# Altium project Microcontroller Hardware.PrjPcb (part 3 of 3)

## Sheet MCU025B_XDS110_USB_Power.SchDoc
size 431 x 279 mm; PageSetup: Record=PageOptions|CenterHorizontal=True|CenterVertical=True|PrintScale=1.00|XCorrection=1.00|YCorrection=1.00|PrintKind=0|BorderSize=5000000|LeftOffset=0|BottomOffset=0|Orientation=2|PaperLength=1000|PaperWidth=1000|Scale=100|PaperSource=15|PrintQuality=600|MediaType=1|DitherType=10|PaperKind=Letter|PrintScaleMode=1; SPICEModelCacheRPHRLOIN: <root> / <DocumentId>RPHRLOIN</DocumentId> / </root>; Organization: ORGANIZATION; Address1: ADDRESS 1; Address2: ADDRESS 2; Address3: ADDRESS 3; Address4: ADDRESS 4; Revision: -; ENG_APP_DATE: --/--/--; DSN_APP_DATE: --/--/--; CHK_APP_DATE: --/--/--
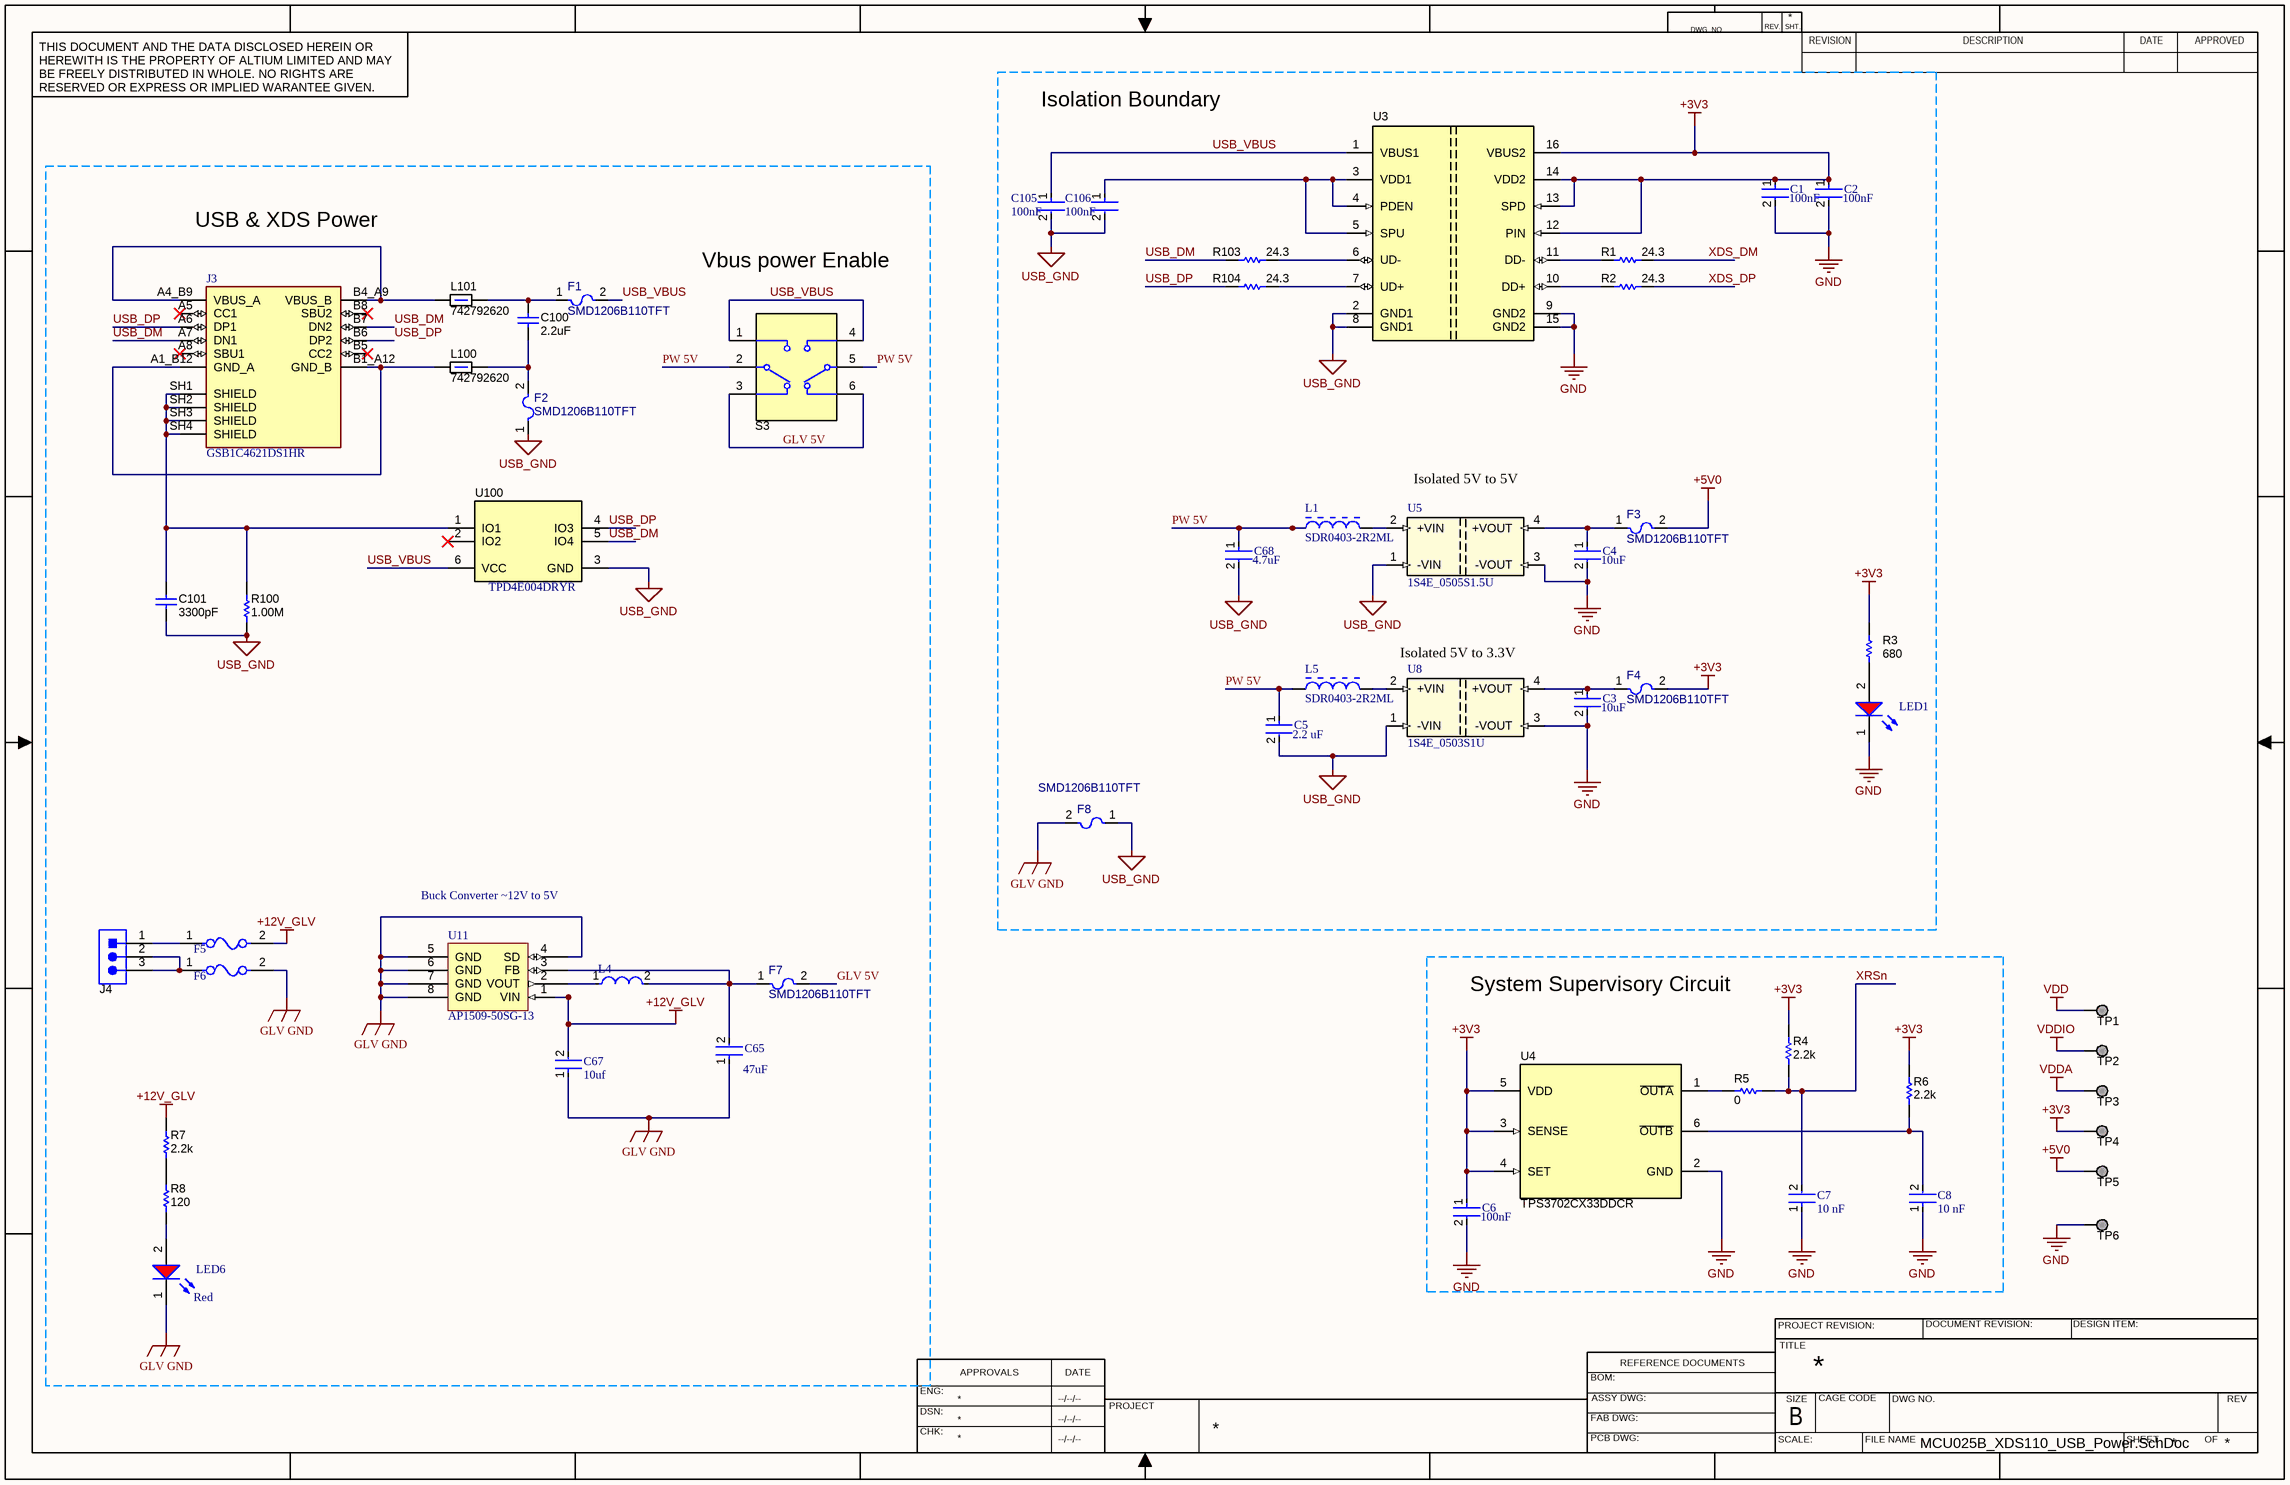
[diagram p7: MCU025B_XDS110_USB_Power.SchDoc]

### Parts
(Parts that share a designator on the sheet are numbered #1, #2 ... from top to bottom, then left to right.)
C1  Capacitance: 100nF  [FP-CL10-IPC_C]  (hidden comment: CL10B104KA8NFNC)
C2  Capacitance: 100nF  [FP-CL10-IPC_C]  (hidden comment: CL10B104KA8NFNC)
C3  Capacitance: 10uF  [FP-GRM188-0_15-MFG]  (hidden comment: GRM188R61A106ME69D)
C4  Capacitance: 10uF  [FP-GRM188-0_15-MFG]  (hidden comment: GRM188R61A106ME69D)
C5  Capacitance: 2.2 uF  [FP-CC0805-0_85-MFG]  (hidden comment: CC0805KKX7R5BB225)
C6  Capacitance: 100nF  [FP-CL10-IPC_C]  (hidden comment: CL10B104KA8NFNC)
C7  Capacitance: 10 nF  [FP-CC0603-DA-MFG]  (hidden comment: CC0603KRX7R6BB103)
C8  Capacitance: 10 nF  [FP-CC0603-DA-MFG]  (hidden comment: CC0603KRX7R6BB103)
C65  47uF  [FP-GRM31C-0_2-e0_3_0_8-IPC_C]
C67  10uf  [FP-GRM21B-0_1-IPC_C]
C68  Capacitance: 4.7uF  [FP-CL10-IPC_A]  (hidden comment: CL10X475KQ8NNNC)
C100  ValueDisplayed: 2.2uF  [0402]  (hidden comment: GRM155R60J225KE95D)
C101  ValueDisplayed: 3300pF  [0402]  (hidden comment: GRM155R71H332KA01D)
C105  Capacitance: 100nF  [FP-CL10-IPC_C]  (hidden comment: CL10B104KA8NFNC)
C106  Capacitance: 100nF  [FP-CL10-IPC_C]  (hidden comment: CL10B104KA8NFNC)
F1  SMD1206B110TFT  [SMD1206B110TFT-Footprint-1]
F2  SMD1206B110TFT  [SMD1206B110TFT-Footprint-1]
F3  SMD1206B110TFT  [SMD1206B110TFT-Footprint-1]
F4  SMD1206B110TFT  [SMD1206B110TFT-Footprint-1]
F5  MF-MSMF110/16-2  [FP-MF-MSMF110-16-MFG]  (value not drawn)
F6  MF-MSMF110/16-2  [FP-MF-MSMF110-16-MFG]  (value not drawn)
F7  SMD1206B110TFT  [SMD1206B110TFT-Footprint-1]
F8  SMD1206B110TFT  [SMD1206B110TFT-Footprint-1]
J3  GSB1C4621DS1HR  [AMPHENOL_GSB1C4621DS1HR]
J4#2  61300211121  [WURTH_61300211121]  (value not drawn)
L1  SDR0403-2R2ML  [BOUR-SDR0403-2_V]
L4  IHLP2525AHER4R7M01  [FP-IHLP-2525AH-FP_2_413x3-MFG]  (value not drawn)
L5  SDR0403-2R2ML  [BOUR-SDR0403-2_V]
L100  742792620  [0603]
L101  742792620  [0603]
LED1  150080SS75000  [WL-SMCW_0805_150080xx75000]  (value not drawn)
LED6  Color: Red  [WL-SMCW_0805_150080xx75000]  (hidden comment: 150080SS75000)
R1  ValueDisplayed: 24.3  [0402]  (hidden comment: CRCW040224R3FKED)
R2  ValueDisplayed: 24.3  [0402]  (hidden comment: CRCW040224R3FKED)
R3  ValueDisplayed: 680  [0402]  (hidden comment: CRCW0402680RJNED)
R4  ValueDisplayed: 2.2k  [0402]  (hidden comment: CRCW04022K20JNED)
R5  ValueDisplayed: 0  [0402]  (hidden comment: CRCW04020000Z0ED)
R6  ValueDisplayed: 2.2k  [0603]  (hidden comment: CRCW06032K20JNEA)
R7  ValueDisplayed: 2.2k  [0603]  (hidden comment: CRCW06032K20JNEA)
R8  ValueDisplayed: 120  [0603]  (hidden comment: RC0603FR-07120RL)
R100  ValueDisplayed: 1.00M  [0402]  (hidden comment: CRCW04021M00FKED)
R103  ValueDisplayed: 24.3  [0402]  (hidden comment: CRCW040224R3FKED)
R104  ValueDisplayed: 24.3  [0402]  (hidden comment: CRCW040224R3FKED)
S3  CAS-220TA  [SW_CAS-220TA]  (value not drawn)
TP1  TESTPOINT  [TESTPOINT]  (value not drawn)  (no BOM)
TP2  TESTPOINT  [TESTPOINT]  (value not drawn)  (no BOM)
TP3  TESTPOINT  [TESTPOINT]  (value not drawn)  (no BOM)
TP4  TESTPOINT  [TESTPOINT]  (value not drawn)  (no BOM)
TP5  TESTPOINT  [TESTPOINT]  (value not drawn)  (no BOM)
TP6  TESTPOINT  [TESTPOINT]  (value not drawn)  (no BOM)
U3  ADuM3160BRWZ  [SOIC-16]  (value not drawn)
U4  TPS3702CX33DDCR  [DDC0006A_N]
U5  1S4E_0505S1.5U  [1S4E_0503S1U-Footprint-1]
U8  1S4E_0503S1U  [1S4E_0503S1U-Footprint-1]
U11  AP1509-50SG-13  [AP1509-50SG-13-Footprint-1]
U100  TPD4E004DRYR  [DRY0006A]

### Nets
+3V3: C1.1 C2.1 C6.1 F4.2 R3.2 R4.2 R6.2 TP4.1 U3.12(PIN) U3.13(SPD) U3.14(VDD2) U3.16(VBUS2) U4.3(SENSE) U4.4(SET) U4.5(VDD)
+5V0: F3.2 TP5.1
+12V_GLV: C67.2 F5.2 R7.2 U11.1(VIN)
GLV GND: C65.1 C67.1 F6.2 F8.2 LED6.1(K) U11.4(SD) U11.5(GND) U11.6(GND) U11.7(GND) U11.8(GND)
GND: C1.2 C2.2 C3.2 C4.2 C6.2 C7.1 C8.1 LED1.1(K) TP6.1 U3.9(GND2) U3.15(GND2) U4.2(GND) U5.3(-VOUT) U8.3(-VOUT)
USB_GND: C5.2 C68.2 C101.2 C105.2 C106.2 F2.1 F8.1 R100.1 U3.2(GND1) U3.8(GND1) U5.1(-VIN) U8.1(-VIN) U100.3(GND)
VDD: TP1.1
VDDA: TP3.1
VDDIO: TP2.1
GLV 5V: F7.2 S3.3 S3.6
PW 5V: C5.1 C68.1 L1.1 L5.1 S3.2 S3.5
USB_DM: J3.A7(DN1) J3.B7(DN2) R103.1 U100.5(IO4)
USB_DP: J3.A6(DP1) J3.B6(DP2) R104.1 U100.4(IO3)
USB_VBUS: C105.1 F1.2 S3.1 S3.4 U3.1(VBUS1) U100.6(VCC)
XDS_DM: R1.2
XDS_DP: R2.2
XRSn: C7.2 R4.1 R5.2
NetC3_1: C3.1 F4.1 U8.4(+VOUT)
NetC4_1: C4.1 F3.1 U5.4(+VOUT)
NetC8_2: C8.2 R6.1 U4.6(~{OUTB})
NetC65_2: C65.2 F7.1 L4.2 U11.3(FB)
NetC100_1: C100.1 F1.1 L101.2
NetC100_2: C100.2 F2.2 L100.2
NetC101_1: C101.1 J3.SH1(SHIELD) J3.SH2(SHIELD) J3.SH3(SHIELD) J3.SH4(SHIELD) R100.2 U100.1(IO1)
NetC106_1: C106.1 U3.3(VDD1) U3.4(PDEN) U3.5(SPU)
NetF5_1: F5.1 J4#2.1
NetF6_1: F6.1 J4#2.2 J4#2.3
NetJ3_A1_B12: J3.A1_B12(GND_A) J3.B1_A12(GND_B) L100.1
NetJ3_A4_B9: J3.A4_B9(VBUS_A) J3.B4_A9(VBUS_B) L101.1
NetL1_2: L1.2 U5.2(+VIN)
NetL4_1: L4.1 U11.2(VOUT)
NetL5_2: L5.2 U8.2(+VIN)
NetLED1_2: LED1.2(A) R3.1
NetLED6_2: LED6.2(A) R8.1
NetR1_1: R1.1 U3.11(DD-)
NetR2_1: R2.1 U3.10(DD+)
NetR5_1: R5.1 U4.1(~{OUTA})
NetR7_1: R7.1 R8.2
NetR103_2: R103.2 U3.6(UD-)
NetR104_2: R104.2 U3.7(UD+)

Not connected (* = marked no-connect by the designer): J3 A5(CC1)* A8(SBU1)* B5(CC2)* B8(SBU2)*; U100 2(IO2)*

### Notes on the sheet
- Isolation Boundary
- USB & XDS Power
- Vbus power Enable
- (near U5) Isolated 5V to 5V
- (near U8) Isolated 5V to 3.3V
- Buck Converter ~12V to 5V
- System Supervisory Circuit
- DWG. NO.
- REV.
- SHT.
- THIS DOCUMENT AND THE DATA DISCLOSED HEREIN OR HEREWITH IS THE PROPERTY OF ALTIUM LIMITED AND MAY BE FREELY DISTRIBUTED IN WHOLE. NO RIGHTS ARE RESERVED OR EXPRESS OR IMPLIED WARANTEE GIVEN.
- REVISION
- DESCRIPTION
- DATE
- APPROVED
- APPROVALS
- REFERENCE DOCUMENTS
- PROJECT REVISION:
- TITLE
- DOCUMENT REVISION:
- DESIGN ITEM:
- ENG:
- DSN:
- CHK:
- PROJECT
- BOM:
- FAB DWG:
- PCB DWG:
- ASSY DWG:
- SCALE:
- SIZE
- B
- CAGE CODE
- FILE NAME
- DWG NO.
- SHEET
- OF
- REV

### Library data of the parts
C1 C2 C6 C105 C106 = CMP-13271-001423-1: Cap Ceramic 100nF 25V X7R ±10% Pad SMD 0603 +125°C T/R; Depth: 0.8mm; Tolerance: 10%; Case Code (Imperial): 0603; Max Operating Temperature: 125°C; Min Operating Temperature: -55°C; Dielectric: X7R; Width: 0.031inch; Thickness: 0.035inch; Height: 0.8mm; Length: 1.6mm; Mount: Surface Mount; Voltage Rating: 25V; Case Code (Metric): 1608; Case/Package: 0603; Radiation Hardening: No; Packaging: Tape and Reel
C3 C4 = CMP-06035-003612-1: Chip Multilayer Ceramic Capacitors for General Purpose, 0603, 10uF, X5R, 15%, 20%, 10V; Tolerance: 20%; Dielectric: X5R; Package Quantity: 4000; Width: 0.8mm; Case/Package: 0603; Thickness: 0.035inch; Voltage Rating: 10V; Voltage Rating (DC): 10V; Termination: SMD/SMT; Length: 1.6mm; Lead Free: Lead Free; Mount: Surface Mount; Height: 0.8mm; Depth: 0.8mm; Packaging: Tape and Reel; Weight: 0.000222oz; Min Operating Temperature: -55°C; Case Code (Metric): 1608; Max Operating Temperature: 85°C; Case Code (Imperial): 0603; Material: Ceramic
C5 = CMP-03422-000945-1: CAP CER 2.2UF 6.3V X7R 0805; Manufacturer: Yageo; Tolerance: 0.1; Material: Ceramic; ComponentLink2URL: http://www.yageo.com/documents/recent/UPY-GPHC_Y5V_6.3V-to-50V_8.pdf; Package: CC0805-0.85; Temperature Range Low: -30°C; Temperature: -30°C to +85°C; Footprint Url: http://www.yageo.com/exep/pages/download/literatures/UPY-C_GEN_24.pdf; Category: Cap; Lead Free: Yes; Temperature Range High: +85°C; Octopart: https://octopart.com/cc0805kkx7r5bb225-yageo-29810442; Ipc Land Pattern Name: CAPC200125X85; RoHS: TRUE; Manufacturer Part Number: CC0805KKX7R5BB225; Height: 0.95mm; Value: 2.2 uF; Device Class L1: Passive Components; Automotive: No; Temperature Characteristic: X7R; Device Class L3: Ceramic Capacitors; Voltage Rating: 6.3 V; ComponentLink2Description: Datasheet; Device Class L2: Capacitors; Mouser Description: Multilayer Ceramic Capacitors MLCC - SMD/SMT 2.2uF 6.3V X7R 10%; Digikey Description: CAP CER 2.2UF 6.3V X7R 0805
C7 C8 = CMP-03422-000575-1: CAP CER 10000PF 10V X7R 0603; Manufacturer: YAGEO; Tolerance: 0.1; Description: CC0603 10 nF X7R 10.00% 10 V; Temperature Coefficient: 15%; Value: 10 nF; Material: Ceramic; Footprint Url: http://www.yageo.com/exep/pages/download/literatures/UPY-C_GEN_24.pdf; Temperature Characteristic: X7R; Device Class L2: Capacitors; Voltage: 10 V; Octopart: https://octopart.com/cc0603krx7r6bb103-yageo-25629541; Height: 0.9mm; ComponentLink2Description: Datasheet; Manufacturer Part Number: CC0603KRX7R6BB103; Mouser Description: Cap Ceramic 0.01uF 10V X7R 10% SMD 0603 125°C Paper T/R; Voltage Rating: 10 V; Temperature Range High: +125°C; Temperature Range Low: -55°C; ComponentLink2URL: http://www.yageo.com/documents/recent/UPY-GPHC_X7R_6.3V-to-50V_18.pdf; RoHS: TRUE; Automotive: No; Device Class L1: Passive Components; Lead Free: Yes; Digikey Description: CAP CER 10000PF 10V X7R 0603; Package: CC0603-DA; Category: Cap; Temperature: -55°C to +125°C; Device Class L3: Ceramic Capacitors
C65 = CMP-06035-014928-1: Chip Multilayer Ceramic Capacitors for General Purpose, 1206, 47uF, X5R, 15%, 20%, 10V
C67 = CMP-2007-03453-2: Chip Multilayer Ceramic Capacitors for General Purpose, 0805, 10uF, X5R, 15%, 10%, 16V; Radiation Hardening: No; Thickness: 0.053inch; Voltage Rating (DC): 16V; Lead Free: Lead Free; Package Quantity: 1; Width: 1.25mm; Case Code (Imperial): 0805; Depth: 1.25mm; Packaging: Tape and Reel; Dielectric: X5R; Max Operating Temperature: 85°C; Tolerance: 10%; Voltage Rating: 16V; Voltage: 16V; Capacitance: 10uF; Height: 1.25mm; Case Code (Metric): 2012; Material: Ceramic; Mount: Surface Mount; Case/Package: 0805; REACH SVHC: No SVHC; Length: 2mm; Min Operating Temperature: -55°C; Termination: SMD/SMT
C68 = CMP-13271-001817-1: Cap Ceramic 4.7uF 6.3V X6S ±10% Pad SMD 0603 +105°C T/R; Length: 1.6mm; Tolerance: 10%; Packaging: Tape and Reel; Dielectric: X6S; Lead Free: Lead Free; Package Quantity: 1; Case/Package: 0603; Max Operating Temperature: 105°C; Radiation Hardening: No; Thickness: 0.035inch; Depth: 0.8mm; Case Code (Metric): 1608; Voltage Rating (DC): 6.3V; Height: 0.8mm; Voltage Rating: 6.3V; Mount: Surface Mount; Min Operating Temperature: -55°C; Case Code (Imperial): 0603; Width: 0.031inch
C100 = CMP-0006543-2: CAP, CERM, 2.2 uF, 6.3 V, +/- 10%, X5R, 0402; Manufacturer: MuRata; Polarized: N; Value: 2.2uF; U/M: EA; Cap_F: 2.2µF; Value1: Unknown; VDC_V: 6.3V; TaMin_C: -55°C; TaMax_C: 85°C; SizeArea_mm2: 0.5; SizeAreaWB_mm2: 3; SizeX_mm: 1; SizeZ_mm: 0.6; AEC Category: Q200; CompType: Capacitor; PartNumber: GRM155R60J225KE95D; PackageReference: 0402; RoHS: Y; Tolerance_%: 10%; Value2: 6.3V; MountType: SMT; Technology: Ceramic; TempCo: X5R; Cap_Case: 0402; SizeY_mm: 0.5; Published: 2008-06-19; Publisher: Texas Instruments; LatestRevisionDate: 2017-03-09; ComponentLink1Description: Datasheet link; ComponentLink1URL: http://psearch.en.murata.com/capacitor/product/GRM155R60J225KE95%23.pdf; Supplier 1: Mouser; Supplier Part Number 1: 81-GRM155R60J225KE5D; AEC Qualified: N; AEC Grade: N/A
C101 = CMP-0006688-2: CAP, CERM, 3300 pF, 50 V, +/- 10%, X7R, 0402; Manufacturer: MuRata; Polarized: N; Value: 3300pF; U/M: EA; Cap_F: 3.3nF; Value1: Unknown; VDC_V: 50V; TaMin_C: -55°C; TaMax_C: 125°C; SizeArea_mm2: 0.5; SizeAreaWB_mm2: 3; SizeX_mm: 1; SizeZ_mm: 0.6; AEC Category: Q200; CompType: Capacitor; PartNumber: GRM155R71H332KA01D; PackageReference: 0402; RoHS: Y; Tolerance_%: 10%; Value2: 50V; MountType: SMT; Technology: Ceramic; TempCo: X7R; Cap_Case: 0402; SizeY_mm: 0.5; Published: 2008-06-19; Publisher: Texas Instruments; LatestRevisionDate: 2017-03-09; ComponentLink1Description: Datasheet link; ComponentLink1URL: http://search.murata.co.jp/Ceramy/PnsearchViewAction.do?HnOFG=ON&HnNFG=ON&SEL_CNT=50&sLang=en&sKey=GRM155R71H332KA01D&x=9&y=9&search=startwith; Supplier 1: Digi-Key; Supplier Part Number 1: 490-3248-1-ND; Supplier 2: Mouser; Supplier Part Number 2: 81-GRM36X332K50; AEC Qualified: ?
F1-F4 F7 F8 = CMP-005-00016-1: PTC Resettable Fuse
F5 F6 = CMP-07400-000018-1: PTC RESET FUSE 16V 1.1A 1812; Manufacturer: Bourns; Automotive Grade: Grade 3; Trip Current: 2.2A; Trip Time: 0.3s; Value: 0.04-0.21Ω; Current Rating: 100A; Category: Fuse; ComponentLink2Description: Datasheet; Temperature: -40°C to +85°C; Octopart: https://octopart.com/mf-msmf110%2F16-2-bourns-40767; Ambient Temperature Range Low: -40°C; Manufacturer Part Number: MF-MSMF110/16-2; Device Class L3: unset; RoHS: TRUE; Device Class L2: PTC Resettable Fuses; Package: MF-MSMF110/16; Digikey Description: PTC RESET FUSE 16V 1.1A 1812; Height: 0.85mm; Mouser Description: Resettable Fuses - PPTC 1.1A 16V 0.04ohm; Lead Free: Yes; Automotive: Yes; Hold Current: 1.1A; Resistance: 0.04-0.21Ω; Temperature Range Low: -40°C; Device Class L1: Circuit Protection; Ambient Temperature Range High: +85°C; Voltage Rating: 16V; ComponentLink2URL: https://upverter.com/datasheet/72639194a1e73201de7e7957ee4193eb5a54a50e.pdf; Temperature Range High: +85°C
J3 = CMP-002-00101-2: USB2.0, Type C, Mid Mount, Center Height 0.58MM, Single Row SMT
J4#2 = CMP-0054796-1: Header, 2.54 mm, 3x1, Gold, TH; PartNumber: 61300311121; Manufacturer: Wurth Elektronik; Green_Lifecycle: Active; Green_REACh: Passed; CNHeader: TRUE; CT: FALSE; PackageReference: Header, 2.54mm, 3x1, TH; ClassName: Header; CompType: Header; RoHS: Y; MountType: TH; ComponentLink1Description: Datasheet URL; ComponentLink1URL: http://katalog.we-online.de/em/datasheet/6130xx11121.pdf; Publisher: Texas Instruments; LatestRevisionDate: 26/05/2017; Supplier 1: Digi-Key; Supplier Part Number 1: 732-5316-ND; Supplier 2: Newark; Supplier Part Number 2: 20X0950; Supplier 3: Farnell; Supplier Part Number 3: 356154; Green_EU RoHS: Passed; Green_EU RoHS-2: Incomplete
L1 L5 = CMP-0904-00013-1: SDR0403 Series Power Inductor, 2.2 uF +/- 20 %, 0.047 Ohm, -40 to 125 degC, 2-Pin SMD, RoHS, Tape and Reel; Manufacturer: Bourns; Q: 28; Test Frequency (MHz): 7.96; RDC (Ohm): 0.047 Max.; I sat (A): 3.9 Typ.; Tolerance (%): +/- 20; Inductance (uH): 2.2; SRF (MHz): 80 Min.; I rms (A): 2.6 Max.; PackageReference: SDR0403-2; PackageDescription: 3-Pin SMD, Dia 4.5 mm, Height 3.5 mm; Mounting Technology: Surface Mount; ComponentLink1Description: Manufacturer URL; RoHS: TRUE; ComponentLink1URL: http://www.bourns.com/; ComponentLink2Description: Datasheet; PartNumber: SDR0403-2R2ML; ComponentLink2URL: http://www.bourns.com/data/global/pdfs/sdr0403.pdf; Temperature Range: -40 to 125 degC; DatasheetVersion: Feb-12; Packing: Tape and Reel
L4 = CMP-02424-000390-1: Commercial Inductors, High Saturation Series 4.7uH 3A 78mΩ 20%; Test Frequency: 100kHz; DC Resistance (DCR): 78mR; Saturation Current: 8A; Core Material: Metal; Shielding: Shielded; Self Resonant Frequency: 5MHz; Packaging: Tape and Reel; Height: 1.8mm; Case/Package: 2525; Mount: Surface Mount; Min Operating Temperature: -55°C; Package Quantity: 2000; RMS Current (Irms): 3A; Inductance: 4.7uH; Radiation Hardening: No; Termination: SMD/SMT; Length: 6.86mm; Military Standard: Not; Max DC Current: 8A; Depth: 6.72mm; Height - Seated (Max): 0.071inch; Tolerance: 20%; Lead Free: Lead Free; Inductance Tolerance: 20%; Current Rating: 3A; Width: 6.47mm; Max Operating Temperature: 125°C
L100 L101 = CMP-0003183-2: Ferrite Bead, 100 ohm @ 100 MHz, 0.5 A, 0603; Manufacturer: Wurth Elektronik; Ztyp@1GHz_Ohm: 137.267; ZTyp@100MHz_Ohm: 100; SizeAreaWB_mm2: 4.68; DCR_ohm: 1.5d; Value1: 0.15 ohm; Value: 100 ohm; Imax_A: 5dA; SizeZ_mm: 1; SizeX_mm: 1.6; SizeY_mm: 0.8; Value2: 0.5A; SizeArea_mm2: 1.28; ComponentLink1URL: http://katalog.we-online.de/pbs/datasheet/742792620.pdf; Supplier Part Number 2: 710-742792620; Publisher: Texas Instruments; Supplier 2: Mouser; Published: 2014-04-30; RoHS: Y; MountType: SMT; Supplier 1: Digi-Key; PackageReference: 0603; CompType: Ferrite Bead; LatestRevisionDate: 2017-03-09; PartNumber: 742792620; ComponentLink1Description: Datasheet link; Supplier Part Number 1: 732-1579-1-ND; ValueDisplayed: 100 ohm
LED1 LED6 = CMP-1426-00010-4: Led, Red, 630 Nm, 1.9 V, 30 Ma, 60 Mcd Rohs Compliant: Yes; Reverse Voltage: 5V; Test Current: 20mA; Forward Current: 100mA; Power Dissipation: 72mW; Peak Wavelength: 645nm; Lens Style: Clear, Rectangular; Viewing Angle: 140°; Forward Voltage: 1.9V; Luminous Intensity: 60mcd; Wavelength: 630nm; Max Junction Temperature (Tj): 95°C; Case/Package: 0805; Length: 2mm; RoHS: Compliant; Max Operating Temperature: 85°C; Min Operating Temperature: -40°C; Case Code (Metric): 2012; Case Code (Imperial): 0805; Dominant Wavelength: 630nm; Max Reverse Voltage (DC): 5V; REACH SVHC: Unknown; Packaging: Tape and Reel; Mount: Surface Mount; Width: 1.25mm; Height: 700µm
  LED1: Color: Red
R1 R2 R103 R104 = CMP-0026197-2: RES, 24.3, 1%, 0.063 W, AEC-Q200 Grade 0, 0402; Manufacturer: Vishay-Dale; Value: 24.3; Value_Code: 24R3; Power_W: 63mW; Value2: 0.063W; VDC_V: 50V; TempCo: 100 ppm/C; SizeArea_mm2: 0.5; SizeX_mm: 1; SizeZ_mm: 0.6; EIA_Code: E96; AEC Category: Q200; AEC Qualified: Y; AEC Grade: 0; CompType: Resistor; PartNumber: CRCW040224R3FKED; PackageReference: 0402; RoHS: E; Res_ohm: 24.3; Tolerance_%: 1%; Value1: 1%; MountType: SMT; Technology: Thick Film; SizeY_mm: 0.5; ComponentLink1Description: Datasheet link; ComponentLink1URL: http://www.vishay.com/docs/20035/dcrcwe3.pdf; Supplier 1: Digi-Key; Supplier Part Number 1: 541-24.3LCT-ND; Supplier 2: Newark; Supplier Part Number 2: 52K6877; Supplier 3: Mouser; Supplier Part Number 3: 71-CRCW0402-24.3-E3
R3 = CMP-0026962-3: RES, 680, 5%, 0.063 W, AEC-Q200 Grade 0, 0402; Manufacturer: Vishay-Dale; Power_W: 63mW; TempCo: 200 ppm/C; Value_Code: 680R; Value: 680; EIA_Code: E24; SizeX_mm: 1; SizeY_mm: 0.5; SizeZ_mm: 0.6; Value2: 0.063W; CompType: Resistor; AEC Qualified: Y; VDC_V: 50V; AEC Category: Q200; AEC Grade: 0; Supplier Part Number 2: 59M6744; Supplier 2: Newark; Supplier Part Number 3: 71-CRCW0402J-680-E3; Supplier 3: Mouser; RoHS: E; Value1: 5%; MountType: SMT; Supplier 1: Digi-Key; PackageReference: 0402; Tolerance_%: 5%; Res_ohm: 680; SizeArea_mm2: 0.5; PartNumber: CRCW0402680RJNED; ComponentLink1Description: Datasheet link; Supplier Part Number 1: 541-680JCT-ND; Technology: Thick Film; ComponentLink1URL: http://www.vishay.com/docs/20035/dcrcwe3.pdf
R4 = CMP-0026890-5: RES, 2.2 k, 5%, 0.063 W, AEC-Q200 Grade 0, 0402; Manufacturer: Vishay-Dale; Value: 2.2k; Value_Code: 2k20; Power_W: 63mW; Value2: 0.063W; VDC_V: 50V; TempCo: 200 ppm/C; SizeArea_mm2: 0.5; SizeX_mm: 1; SizeZ_mm: 0.6; EIA_Code: E24; AEC Category: Q200; AEC Qualified: Y; AEC Grade: 0; CompType: Resistor; PartNumber: CRCW04022K20JNED; PackageReference: 0402; RoHS: E; Res_ohm: 2.2k; Tolerance_%: 5%; Value1: 5%; MountType: SMT; Technology: Thick Film; SizeY_mm: 0.5; ComponentLink1Description: Datasheet link; ComponentLink1URL: http://www.vishay.com/docs/20035/dcrcwe3.pdf; Supplier 1: Digi-Key; Supplier Part Number 1: 541-2.2KJCT-ND; Supplier 2: Newark; Supplier Part Number 2: 59M6710; Supplier 3: Mouser; Supplier Part Number 3: 71-CRCW0402J-2.2K-E3
R5 = CMP-0026822-3: RES, 0, 5%, 0.063 W, AEC-Q200 Grade 0, 0402; Manufacturer: Vishay-Dale; Value: 0; Value_Code: 0000; Power_W: 63mW; Value2: 0.063W; VDC_V: 50V; TempCo: 200 ppm/C; SizeArea_mm2: 0.5; SizeX_mm: 1; SizeZ_mm: 0.6; EIA_Code: E24; AEC Category: Q200; AEC Qualified: Y; CompType: Resistor; PartNumber: CRCW04020000Z0ED; PackageReference: 0402; RoHS: E; Res_ohm: 0; Tolerance_%: 5%; Value1: 5%; MountType: SMT; Technology: Thick Film; SizeY_mm: 0.5; ComponentLink1Description: Datasheet link; ComponentLink1URL: http://www.vishay.com/docs/20035/dcrcwe3.pdf; Supplier 1: Digi-Key; Supplier Part Number 1: 541-0.0JCT-ND; Supplier 2: Newark; Supplier Part Number 2: 52K6543; Supplier 3: Mouser; Supplier Part Number 3: 71-CRCW0402-0-E3; AEC Grade: 0
R6 R7 = CMP-0025769-4: RES, 2.2 k, 5%, 0.1 W, AEC-Q200 Grade 0, 0603; Manufacturer: Vishay-Dale; Value: 2.2k; Value_Code: 2k20; Power_W: 100mW; Value2: 0.1W; VDC_V: 75V; TempCo: 200 ppm/C; SizeArea_mm2: 1.28; SizeX_mm: 1.6; SizeY_mm: 0.8; SizeZ_mm: 1; EIA_Code: E24; AEC Category: Q200; AEC Qualified: Y; AEC Grade: 0; CompType: Resistor; PartNumber: CRCW06032K20JNEA; PackageReference: 0603; RoHS: E; Res_ohm: 2.2k; Tolerance_%: 5%; Value1: 5%; MountType: SMT; Technology: Thick Film; ComponentLink1Description: Datasheet link; ComponentLink1URL: http://www.vishay.com/docs/20035/dcrcwe3.pdf; Supplier 1: Digi-Key; Supplier Part Number 1: 541-2.2KGCT-ND; Supplier 2: Newark; Supplier Part Number 2: 59M6776; Supplier 3: Farnell; Supplier Part Number 3: 1652868
R8 = CMP-0022769-3: RES, 120, 1%, 0.1 W, 0603; Manufacturer: Yageo America; Value: 120; Value_Code: 120R; Power_W: 100mW; Value2: 0.1W; VDC_V: 150V; TempCo: 200 ppm/C; SizeArea_mm2: 1.28; SizeX_mm: 1.6; SizeY_mm: 0.8; SizeZ_mm: 1; U/M: EA; AEC Category: Q200; CompType: Resistor; PartNumber: RC0603FR-07120RL; PackageReference: 0603; RoHS: Y; Res_ohm: 120; Tolerance_%: 1%; Value1: 1%; MountType: SMT; Technology: Thick Film; Published: 2008-06-26; Publisher: Texas Instruments; LatestRevisionDate: 2017-03-09; ComponentLink1Description: Datasheet link; ComponentLink1URL: http://www.yageo.com/pdf/Pu-RC0603_51_PbFree_L_2.pdf; Supplier 1: Digi-Key; Supplier Part Number 1: 311-120HRCT-ND; Supplier 2: Mouser; Supplier Part Number 2: 603-RC0603FR-07120RL; Supplier 3: Farnell; Supplier Part Number 3: 9238379; AEC Qualified: ?
R100 = CMP-0026100-2: RES, 1.00 M, 1%, 0.063 W, AEC-Q200 Grade 0, 0402; Manufacturer: Vishay-Dale; Value: 1.00Meg; Res_ohm: 1M; Value_Code: 1M00; Power_W: 63mW; Value2: 0.063W; VDC_V: 50V; TempCo: 100 ppm/C; SizeArea_mm2: 0.5; SizeX_mm: 1; SizeZ_mm: 0.6; EIA_Code: E96; AEC Category: Q200; AEC Qualified: Y; AEC Grade: 0; CompType: Resistor; PartNumber: CRCW04021M00FKED; PackageReference: 0402; RoHS: E; Tolerance_%: 1%; Value1: 1%; MountType: SMT; Technology: Thick Film; SizeY_mm: 0.5; ComponentLink1Description: Datasheet link; ComponentLink1URL: http://www.vishay.com/docs/20035/dcrcwe3.pdf; Supplier 1: Digi-Key; Supplier Part Number 1: 541-1.00MLCT-ND; Supplier 2: Newark; Supplier Part Number 2: 52K6593; Supplier 3: Mouser; Supplier Part Number 3: 71-CRCW0402-1.0M-E3
S3 = CMP-0002123-2: SLIDE SWITCH DPDT  .1A, SMT; Manufacturer: Copal Electronics; VDC_V: 6V; SwitchFunction: On-On; PositionCount: 2; CurrentRating_mA: 100A; PartNumber: CAS-220TA; MountType: SMT; ComponentLink1Description: Datasheet URL; ComponentLink1URL: http://copal-electronics.info/en/0008e/02462.pdf; RoHS: Y; Circuit: DPDT; Orientation: Horizontal; CompType: Switch; PackageReference: SWITCH, 5.4x2.5x3.9mm; Publisher: Texas Instruments; LatestRevisionDate: 2017-03-09; Supplier 1: Digi-Key; Supplier Part Number 1: CAS220JCT-ND
TP1-TP6 = CMP-0078143-2: TEST POINT.  No entry in BOM.; CompType: Testpoint; PackageReference: N/A; Manufacturer: N/A; PartNumber: N/A; Library Reference: TESTPOINT
U3 = CMP-0074604-2: Full/Low Speed 2.5 kV USB Digital Isolator, SOIC-16; Manufacturer: Analog Devices; PartNumber: ADuM3160BRWZ; MountType: SMT; ComponentLink1Description: Datasheet URL; ComponentLink1URL: http://www.analog.com/media/en/technical-documentation/data-sheets/ADuM3160.pdf; RoHS: Y; PackageReference: SOIC, 16-Leads, Body 10.3x7.5mm, Pitch 1.27mm; Publisher: Texas Instruments; LatestRevisionDate: 2017-06-16; Supplier 1: Digi-Key; Supplier Part Number 1: ADUM3160BRWZ-ND; Supplier 2: Newark; Supplier Part Number 2: 85R6420; Supplier 3: Mouser; Supplier Part Number 3: 584-ADUM3160BRWZ
U4 = CMP-0067340-2: High-Accuracy, Fixed-Threshold OV/UV Monitor, DDC0006A (SOT-23-T-6); Alternate PartNumber: TPS3702CX33DDCT; Manufacturer: Texas Instruments; SizeArea_mm2: 4.8675; SizeAreaWB_mm2: 10.4675; SizeX_mm: 1.65; SizeY_mm: 2.95; SizeZ_mm: 0.87; CompType: IC; U/M: EA; PartNumber: TPS3702CX33DDCR; PackageReference: DDC0006A; PackageDescription: SOT-23-T-6; MountType: SMT; ComponentLink1Description: Datasheet Link; ComponentLink1URL: http://www.ti.com/lit/ds/symlink/tps3702.pdf; RoHS: Y; Publisher: Texas Instruments; LatestRevisionDate: 2017-06-09; Alternate Manufacturer: Texas Instruments
U5 = CMP-019-00058-1: Isolated Module DC DC Converters 5v~5v; Max Supply Voltage: 5.5V; Output Voltage: 5V; Min Supply Voltage: 4.5V
U8 = CMP-019-00057-3: Isolated Module DC DC Converters
U11 = CMP-019-00049-3: Switching Regulator, Voltage-mode, 2A, 173kHz Switching Freq-Max, BIPolar, PDSO8; Max Supply Voltage: 22V; Max Operating Temperature: 85°C; RoHS Compliant: Yes; Frequency: 173kHz; Pins: 8; Min Operating Temperature: -20°C; Case/Package: SOP
U100 = CMP-0043115-2: ESD-Protection Array for High-Speed Data Interfaces, 4 Channels, -40 to +85 degC, 6-pin SON (DRY), Green (RoHS & no Sb/Br); Manufacturer: Texas Instruments; 1394 / Firewire: TRUE; Breakdown Voltage(Min)(V): 6; IEC 61000-4-2 Air-Gap(+/- kV): 12; IEC 61000-4-2 Contact(+/- kV): 8; IO Capacitance(Typ)(pF): 1.6; IO Leakage Current(nA): 1; SubFamily: ESD Solution; AEC Category: Q200; AEC Qualified: N; CompType: IC; SizeArea_mm2: 1.45; SizeAreaWB_mm2: 4.9; SizeX_mm: 1.0; SizeZ_mm: 0.6; DatasheetVersion: SLVS729A; PackageVersion: revF, Dec-2011; PackageReference: DRY0006A; PackageDescription: USON-6; Eco-Plan: Green (RoHS & no Sb/Br); Serial ATA / eSATA: TRUE; USB High Speed: TRUE; PartNumber: TPD4E004DRYR; ComponentLink1Description: Datasheet Link; ComponentLink1URL: http://www.ti.com/lit/ds/symlink/tpd4e004.pdf; ComponentLink2Description: Product Folder; ComponentLink2URL: http://www.ti.com/product/tpd4e004; ComponentLink3Description: Online Datasheet; ComponentLink3URL: http://www.ti.com/product/tpd4e004/datasheet; Mounting Technology: Surface Mount; MountType: SMT; RoHS: Y; SizeY_mm: 1.45

## Nets that join several sheets
+3V3: MCU025B_AltRouting_Misc (12 pins), MCU025B_Connectors (6 pins), MCU025B_F280049C_Device (6 pins), MCU025B_XDS110_MCU (31 pins), MCU025B_XDS110_Target_Interface (J102.1 R57.2 U12.8), MCU025B_XDS110_USB_Power (15 pins)
+5V0: MCU025B_AltRouting_Misc (C42.1 U7.15), MCU025B_Connectors (6 pins), MCU025B_XDS110_MCU (R62.1), MCU025B_XDS110_USB_Power (F3.2 TP5.1)
GND: MCU025B_AltRouting_Misc (17 pins), MCU025B_Connectors (14 pins), MCU025B_F280049C_Device (42 pins), MCU025B_XDS110_MCU (33 pins), MCU025B_XDS110_Target_Interface (J102.3 J102.5 J102.9 U12.4), MCU025B_XDS110_USB_Power (14 pins)
VDD: MCU025B_F280049C_Device (10 pins), MCU025B_XDS110_USB_Power (TP1.1)
VDDA: MCU025B_F280049C_Device (6 pins), MCU025B_XDS110_USB_Power (TP3.1)
VDDIO: MCU025B_F280049C_Device (12 pins), MCU025B_XDS110_USB_Power (TP2.1)
ADCINA0: MCU025B_Connectors (J5.30), MCU025B_F280049C_Device (R13.1)
ADCINA1: MCU025B_Connectors (J1.30), MCU025B_F280049C_Device (R15.1)
ADCINA2: MCU025B_Connectors (J5.24), MCU025B_F280049C_Device (U1.9)
ADCINA3_P2I: MCU025B_Connectors (J5.29), MCU025B_F280049C_Device (R16.2 U1.10)
ADCINA4_P2OF: MCU025B_Connectors (J5.6), MCU025B_F280049C_Device (R19.1)
ADCINA5: MCU025B_Connectors (J1.23), MCU025B_F280049C_Device (U1.35)
ADCINA6: MCU025B_Connectors (J5.23), MCU025B_F280049C_Device (U1.6)
ADCINA8_P6OF: MCU025B_Connectors (J5.8), MCU025B_F280049C_Device (R22.1)
ADCINA9_P5I: MCU025B_Connectors (J1.29), MCU025B_F280049C_Device (R20.2 U1.38)
ADCINB0: MCU025B_Connectors (J1.24), MCU025B_F280049C_Device (U1.41)
ADCINB1: MCU025B_Connectors (J1.26), MCU025B_F280049C_Device (U1.40)
ADCINB2_P1I: MCU025B_Connectors (J1.27), MCU025B_F280049C_Device (R14.2 U1.7)
ADCINB3: MCU025B_Connectors (J1.6), MCU025B_F280049C_Device (U1.8)
ADCINB4_P4OF: MCU025B_Connectors (J5.5), MCU025B_F280049C_Device (R25.1)
ADCINC0_P3I: MCU025B_Connectors (J1.28), MCU025B_F280049C_Device (R17.2 U1.19)
ADCINC1: MCU025B_Connectors (J5.26), MCU025B_F280049C_Device (U1.29)
ADCINC2: MCU025B_Connectors (J1.25), MCU025B_F280049C_Device (U1.21)
ADCINC3_P4I: MCU025B_Connectors (J5.27), MCU025B_F280049C_Device (R18.2)
ADCINC4: MCU025B_Connectors (J1.8), MCU025B_F280049C_Device (U1.17)
ADCINC5_P6I: MCU025B_Connectors (J5.28), MCU025B_F280049C_Device (R21.2)
ADCINC14: MCU025B_Connectors (J5.25), MCU025B_F280049C_Device (U1.44)
EQEP1A: MCU025B_AltRouting_Misc (U7.16), MCU025B_Connectors (C43.1 J12.1 R48.1)
EQEP1B: MCU025B_AltRouting_Misc (U7.14), MCU025B_Connectors (C44.1 J12.2 R49.1)
EQEP1I: MCU025B_AltRouting_Misc (U7.13), MCU025B_Connectors (C45.1 J12.3 R50.1)
GPIO0: MCU025B_Connectors (J8.40), MCU025B_F280049C_Device (U1.79)
GPIO1: MCU025B_Connectors (J8.39), MCU025B_F280049C_Device (U1.78)
GPIO2_BP: MCU025B_AltRouting_Misc (R71.2), MCU025B_Connectors (J8.36)
GPIO2_FSIRXD1: MCU025B_AltRouting_Misc (R71.1), MCU025B_Connectors (J11.7), MCU025B_F280049C_Device (U1.77)
GPIO3: MCU025B_Connectors (J8.35), MCU025B_F280049C_Device (U1.76)
GPIO4: MCU025B_Connectors (J4#1.36), MCU025B_F280049C_Device (U1.75)
GPIO5: MCU025B_Connectors (J4#1.35), MCU025B_F280049C_Device (U1.89)
GPIO6_BP: MCU025B_AltRouting_Misc (R44.2), MCU025B_Connectors (J8.38)
GPIO6_FSITXD0: MCU025B_AltRouting_Misc (R44.1), MCU025B_Connectors (J11.6), MCU025B_F280049C_Device (U1.97)
GPIO7_BP: MCU025B_AltRouting_Misc (R45.2), MCU025B_Connectors (J8.37)
GPIO7_FSITXCLK: MCU025B_AltRouting_Misc (R45.1), MCU025B_Connectors (J11.2), MCU025B_F280049C_Device (U1.84)
GPIO8: MCU025B_Connectors (J4#1.38), MCU025B_F280049C_Device (U1.74)
GPIO9: MCU025B_Connectors (J4#1.37), MCU025B_F280049C_Device (U1.90)
GPIO10: MCU025B_Connectors (J4#1.40), MCU025B_F280049C_Device (U1.93)
GPIO11: MCU025B_Connectors (J4#1.39), MCU025B_F280049C_Device (U1.52)
GPIO12_BP: MCU025B_AltRouting_Misc (R47.2), MCU025B_Connectors (J8.11)
GPIO12_FSIRXD0: MCU025B_AltRouting_Misc (R47.1), MCU025B_Connectors (J11.5), MCU025B_F280049C_Device (U1.51)
GPIO13: MCU025B_Connectors (J1.3), MCU025B_F280049C_Device (U1.50)
GPIO14_BP: MCU025B_Connectors (J8.32), MCU025B_F280049C_Device (U1.96)
GPIO15_BP: MCU025B_Connectors (J8.33), MCU025B_F280049C_Device (U1.95)
GPIO16: MCU025B_Connectors (J4#1.15), MCU025B_F280049C_Device (U1.54)
GPIO17: MCU025B_Connectors (J4#1.14), MCU025B_F280049C_Device (U1.55)
GPIO18_BP: MCU025B_AltRouting_Misc (R28.1), MCU025B_Connectors (J4#1.32)
GPIO18_X2: MCU025B_AltRouting_Misc (R28.2 R31.2), MCU025B_F280049C_Device (U1.68)
GPIO22: MCU025B_Connectors (J5.7), MCU025B_F280049C_Device (U1.83)
GPIO23: MCU025B_AltRouting_Misc (R38.1), MCU025B_Connectors (J4#1.12), MCU025B_F280049C_Device (U1.81)
GPIO24: MCU025B_AltRouting_Misc (R33.1 S2.2), MCU025B_Connectors (J8.15), MCU025B_F280049C_Device (U1.56)
GPIO25_BP: MCU025B_AltRouting_Misc (R72.2), MCU025B_Connectors (J4#1.31)
GPIO25_FSITXD1: MCU025B_AltRouting_Misc (R72.1), MCU025B_Connectors (J11.8), MCU025B_F280049C_Device (U1.57)
GPIO26_BP: MCU025B_Connectors (J8.34), MCU025B_F280049C_Device (U1.58)
GPIO27: MCU025B_Connectors (J8.19), MCU025B_F280049C_Device (U1.59)
GPIO28: MCU025B_F280049C_Device (U1.1), MCU025B_XDS110_Target_Interface (J101.2)
GPIO29: MCU025B_F280049C_Device (U1.100), MCU025B_XDS110_Target_Interface (J101.4)
GPIO30: MCU025B_Connectors (J4#1.33), MCU025B_F280049C_Device (U1.98)
GPIO31: MCU025B_Connectors (J8.14), MCU025B_F280049C_Device (U1.99)
GPIO32: MCU025B_AltRouting_Misc (R34.1 S2.1 S9.5), MCU025B_F280049C_Device (U1.64)
GPIO32_BP: MCU025B_AltRouting_Misc (S9.6), MCU025B_Connectors (J8.31)
GPIO32_CANTX: MCU025B_AltRouting_Misc (S9.4), MCU025B_Connectors (U10.1)
GPIO33_BP: MCU025B_AltRouting_Misc (S9.3), MCU025B_Connectors (J8.13)
GPIO33_CANRX: MCU025B_AltRouting_Misc (S9.1), MCU025B_Connectors (U10.4)
GPIO33_FSIRXCLK: MCU025B_AltRouting_Misc (R46.1), MCU025B_Connectors (J11.1), MCU025B_F280049C_Device (U1.53)
GPIO34: MCU025B_AltRouting_Misc (R39.1), MCU025B_Connectors (J8.12), MCU025B_F280049C_Device (U1.94)
GPIO35: MCU025B_AltRouting_Misc (U7.1), MCU025B_F280049C_Device (U1.63)
GPIO37: MCU025B_AltRouting_Misc (U7.3), MCU025B_F280049C_Device (U1.61)
GPIO39: MCU025B_Connectors (J4#1.13), MCU025B_F280049C_Device (U1.91)
GPIO40: MCU025B_Connectors (J1.4), MCU025B_F280049C_Device (U1.85)
GPIO56: MCU025B_Connectors (J1.7), MCU025B_F280049C_Device (U1.65)
GPIO57: MCU025B_Connectors (J4#1.19), MCU025B_F280049C_Device (U1.66)
GPIO58: MCU025B_Connectors (J4#1.34), MCU025B_F280049C_Device (U1.67)
GPIO59: MCU025B_AltRouting_Misc (U7.4), MCU025B_F280049C_Device (U1.92)
PGA135_GND: MCU025B_Connectors (J1.2), MCU025B_F280049C_Device (R23.2)
PGA246_GND: MCU025B_Connectors (J5.2), MCU025B_F280049C_Device (R24.2)
TCK: MCU025B_F280049C_Device (U1.60), MCU025B_XDS110_Target_Interface (J101.8)
TMS: MCU025B_F280049C_Device (R10.1 U1.62), MCU025B_XDS110_Target_Interface (J101.6)
X1: MCU025B_AltRouting_Misc (C39.1 R35.1 Y2.3), MCU025B_F280049C_Device (U1.69)
XDS_DM: MCU025B_XDS110_MCU (U2.93), MCU025B_XDS110_USB_Power (R1.2)
XDS_DP: MCU025B_XDS110_MCU (U2.94), MCU025B_XDS110_USB_Power (R2.2)
XDS_RESET_OUT: MCU025B_XDS110_MCU (U2.40), MCU025B_XDS110_Target_Interface (J102.10 R57.1 U12.2)
XDS_RXD: MCU025B_XDS110_MCU (U2.33), MCU025B_XDS110_Target_Interface (J101.3)
XDS_TCK_SWDCLK: MCU025B_XDS110_MCU (U2.35), MCU025B_XDS110_Target_Interface (J101.7 J102.4 U12.6)
XDS_TDI: MCU025B_XDS110_MCU (U2.38), MCU025B_XDS110_Target_Interface (J102.8 U12.3)
XDS_TDO_SWO: MCU025B_XDS110_MCU (U2.37), MCU025B_XDS110_Target_Interface (J102.6 U12.5)
XDS_TMS_SWDIO: MCU025B_XDS110_MCU (U2.36), MCU025B_XDS110_Target_Interface (J101.5 J102.2 U12.7)
XDS_TXD: MCU025B_XDS110_MCU (U2.34), MCU025B_XDS110_Target_Interface (J101.1)
XRSn: MCU025B_AltRouting_Misc (C37.1 R32.1 S1.4), MCU025B_Connectors (J4#1.16 J8.16), MCU025B_F280049C_Device (U1.2), MCU025B_XDS110_USB_Power (C7.2 R4.1 R5.2)